# EAGLE design BatteryBalancer (EAGLE 9.2.0)

## Sheet 1 of 4: Connectors
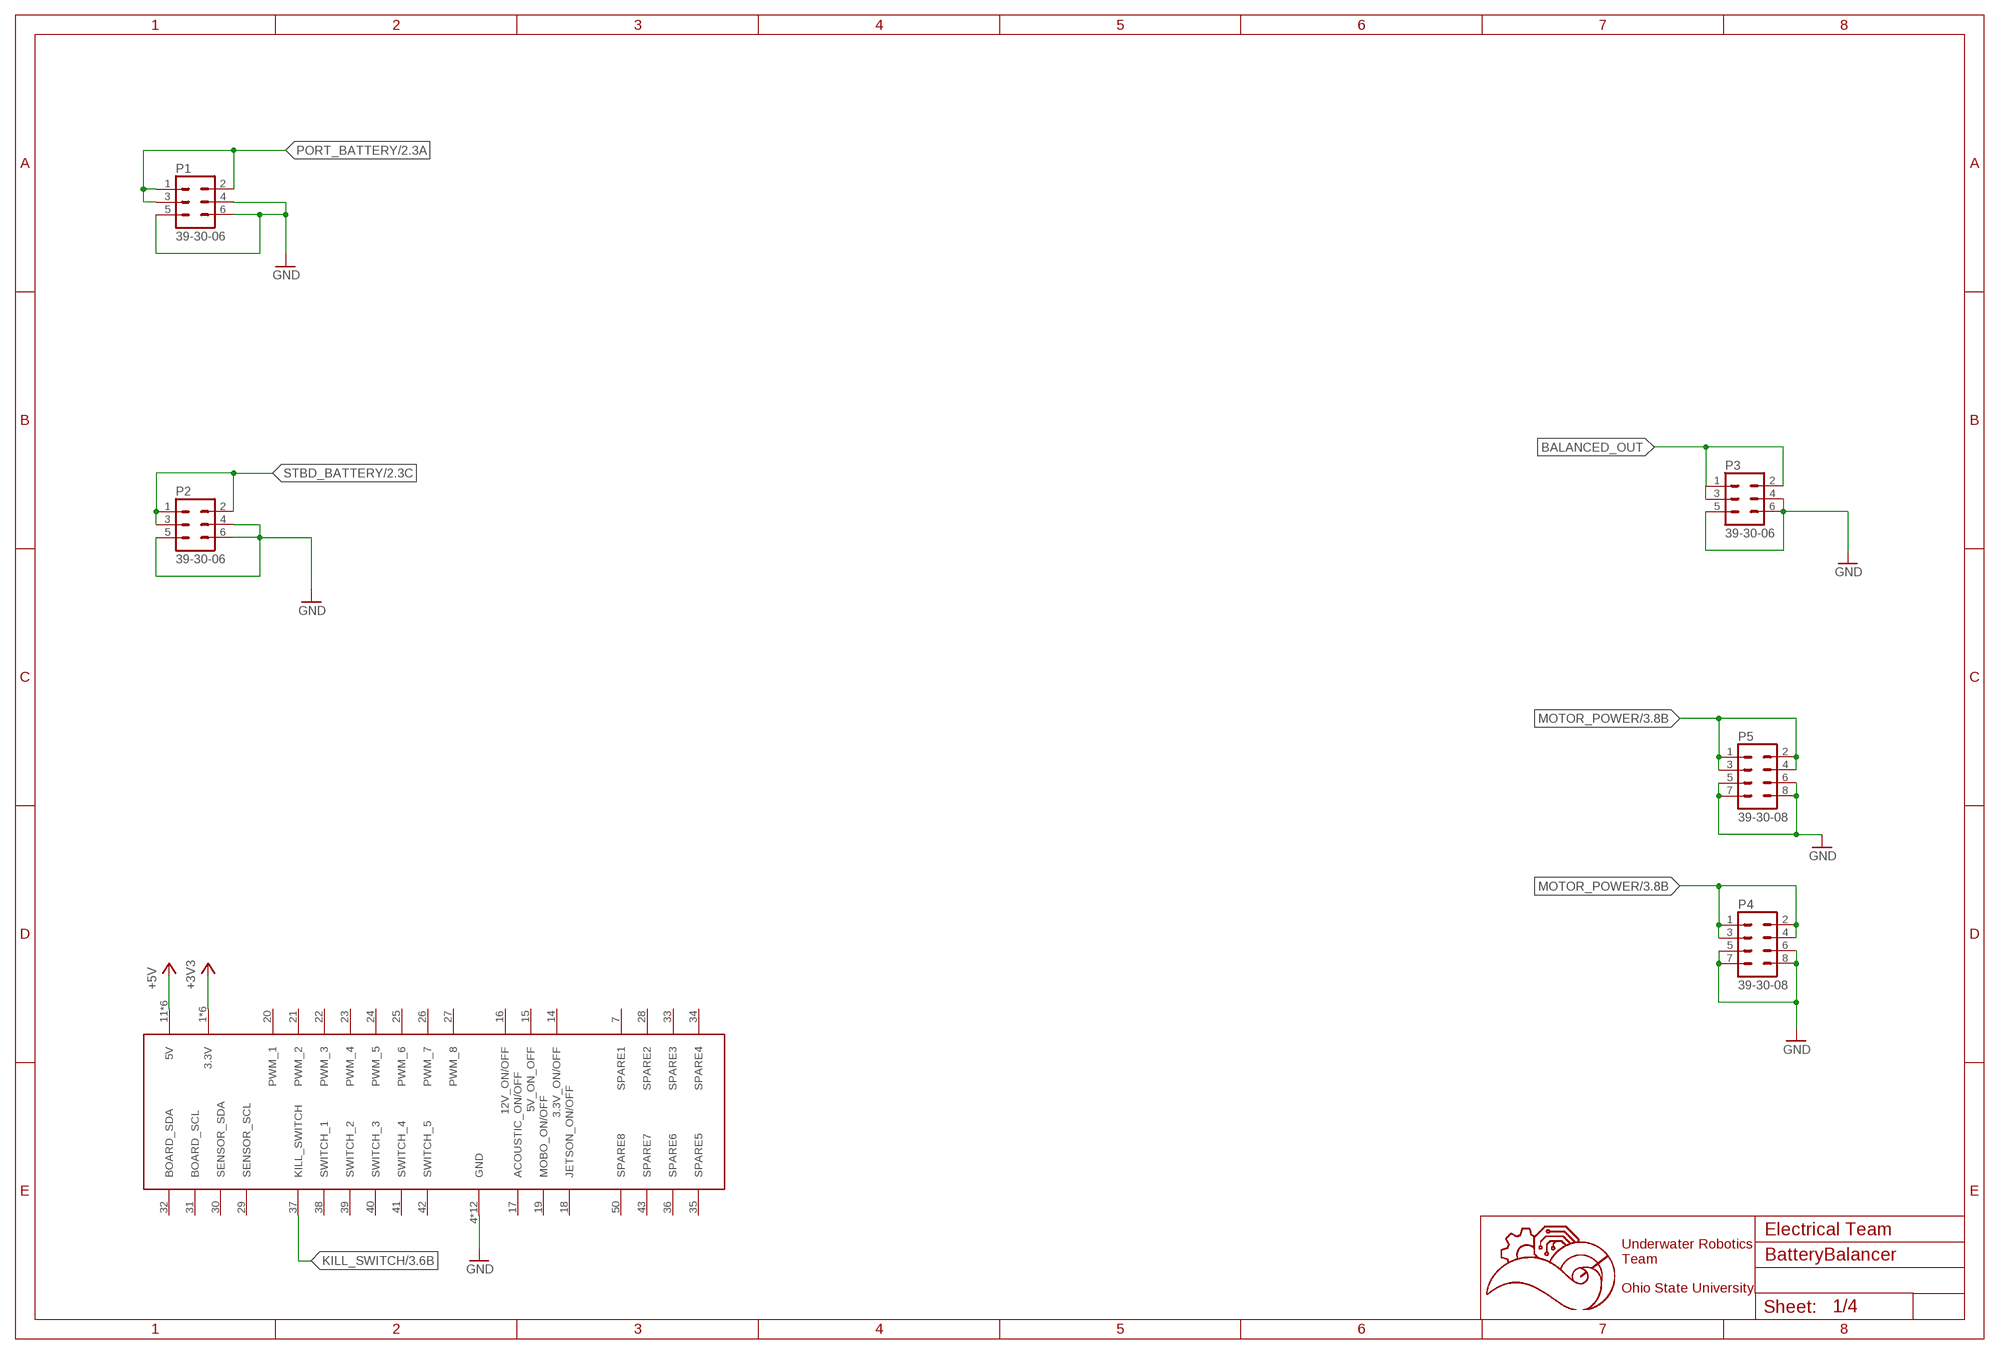
[diagram p0: schematic, sheet 1]

### Parts
P1  39-30-06  [39-30-?06?]
P2  39-30-06  [39-30-?06?]
P3  39-30-06  [39-30-?06?]
P4  39-30-08  [39-30-?08?]
P5  39-30-08  [39-30-?08?]
U$1  5530843-EDGE  [5530843-6-BOARDFINGERS]

### Nets
+3V3: U$1.1(3.3V) U$1.2(3.3V) U$1.3(3.3V) U$1.54(3.3V) U$1.55(3.3V) U$1.56(3.3V) ; also sheet 2
+5V: U$1.11(5V) U$1.12(5V) U$1.13(5V) U$1.44(5V) U$1.45(5V) U$1.46(5V)
BALANCED_OUT: P3.1 P3.2 P3.3
GND: P1.4 P1.5 P1.6 P2.4 P2.5 P2.6 P3.4 P3.5 P3.6 P4.5 P4.6 P4.7 P4.8 P5.5 P5.6 P5.7 P5.8 U$1.4(GND) U$1.5(GND) U$1.6(GND) U$1.8(GND) U$1.9(GND) U$1.10(GND) U$1.47(GND) U$1.48(GND) U$1.49(GND) U$1.51(GND) U$1.52(GND) U$1.53(GND) ; also sheet 2,3
KILL_SWITCH: U$1.37(KILL_SWITCH) ; also sheet 3
MOTOR_POWER: P4.1 P4.2 P4.3 P4.4 P5.1 P5.2 P5.3 P5.4 ; also sheet 3
PORT_BATTERY: P1.1 P1.2 P1.3 ; also sheet 2
STBD_BATTERY: P2.1 P2.2 P2.3 ; also sheet 2
Unconnected: U$1.7(SPARE1) U$1.14(3.3V_ON/OFF) U$1.15(5V_ON_OFF) U$1.16(12V_ON/OFF) U$1.17(ACOUSTIC_ON/OFF) U$1.18(JETSON_ON/OFF) U$1.19(MOBO_ON/OFF) U$1.20(PWM_1) U$1.21(PWM_2) U$1.22(PWM_3) U$1.23(PWM_4) U$1.24(PWM_5) U$1.25(PWM_6) U$1.26(PWM_7) U$1.27(PWM_8) U$1.28(SPARE2) U$1.29(SENSOR_SCL) U$1.30(SENSOR_SDA) U$1.31(BOARD_SCL) U$1.32(BOARD_SDA) U$1.33(SPARE3) U$1.34(SPARE4) U$1.35(SPARE5) U$1.36(SPARE6) U$1.38(SWITCH_1) U$1.39(SWITCH_2) U$1.40(SWITCH_3) U$1.41(SWITCH_4) U$1.42(SWITCH_5) U$1.43(SPARE7) U$1.50(SPARE8)

### Notes on the sheet
- Electrical Team
- Underwater Robotics
  Team
  
  Ohio State University

## Sheet 2 of 4
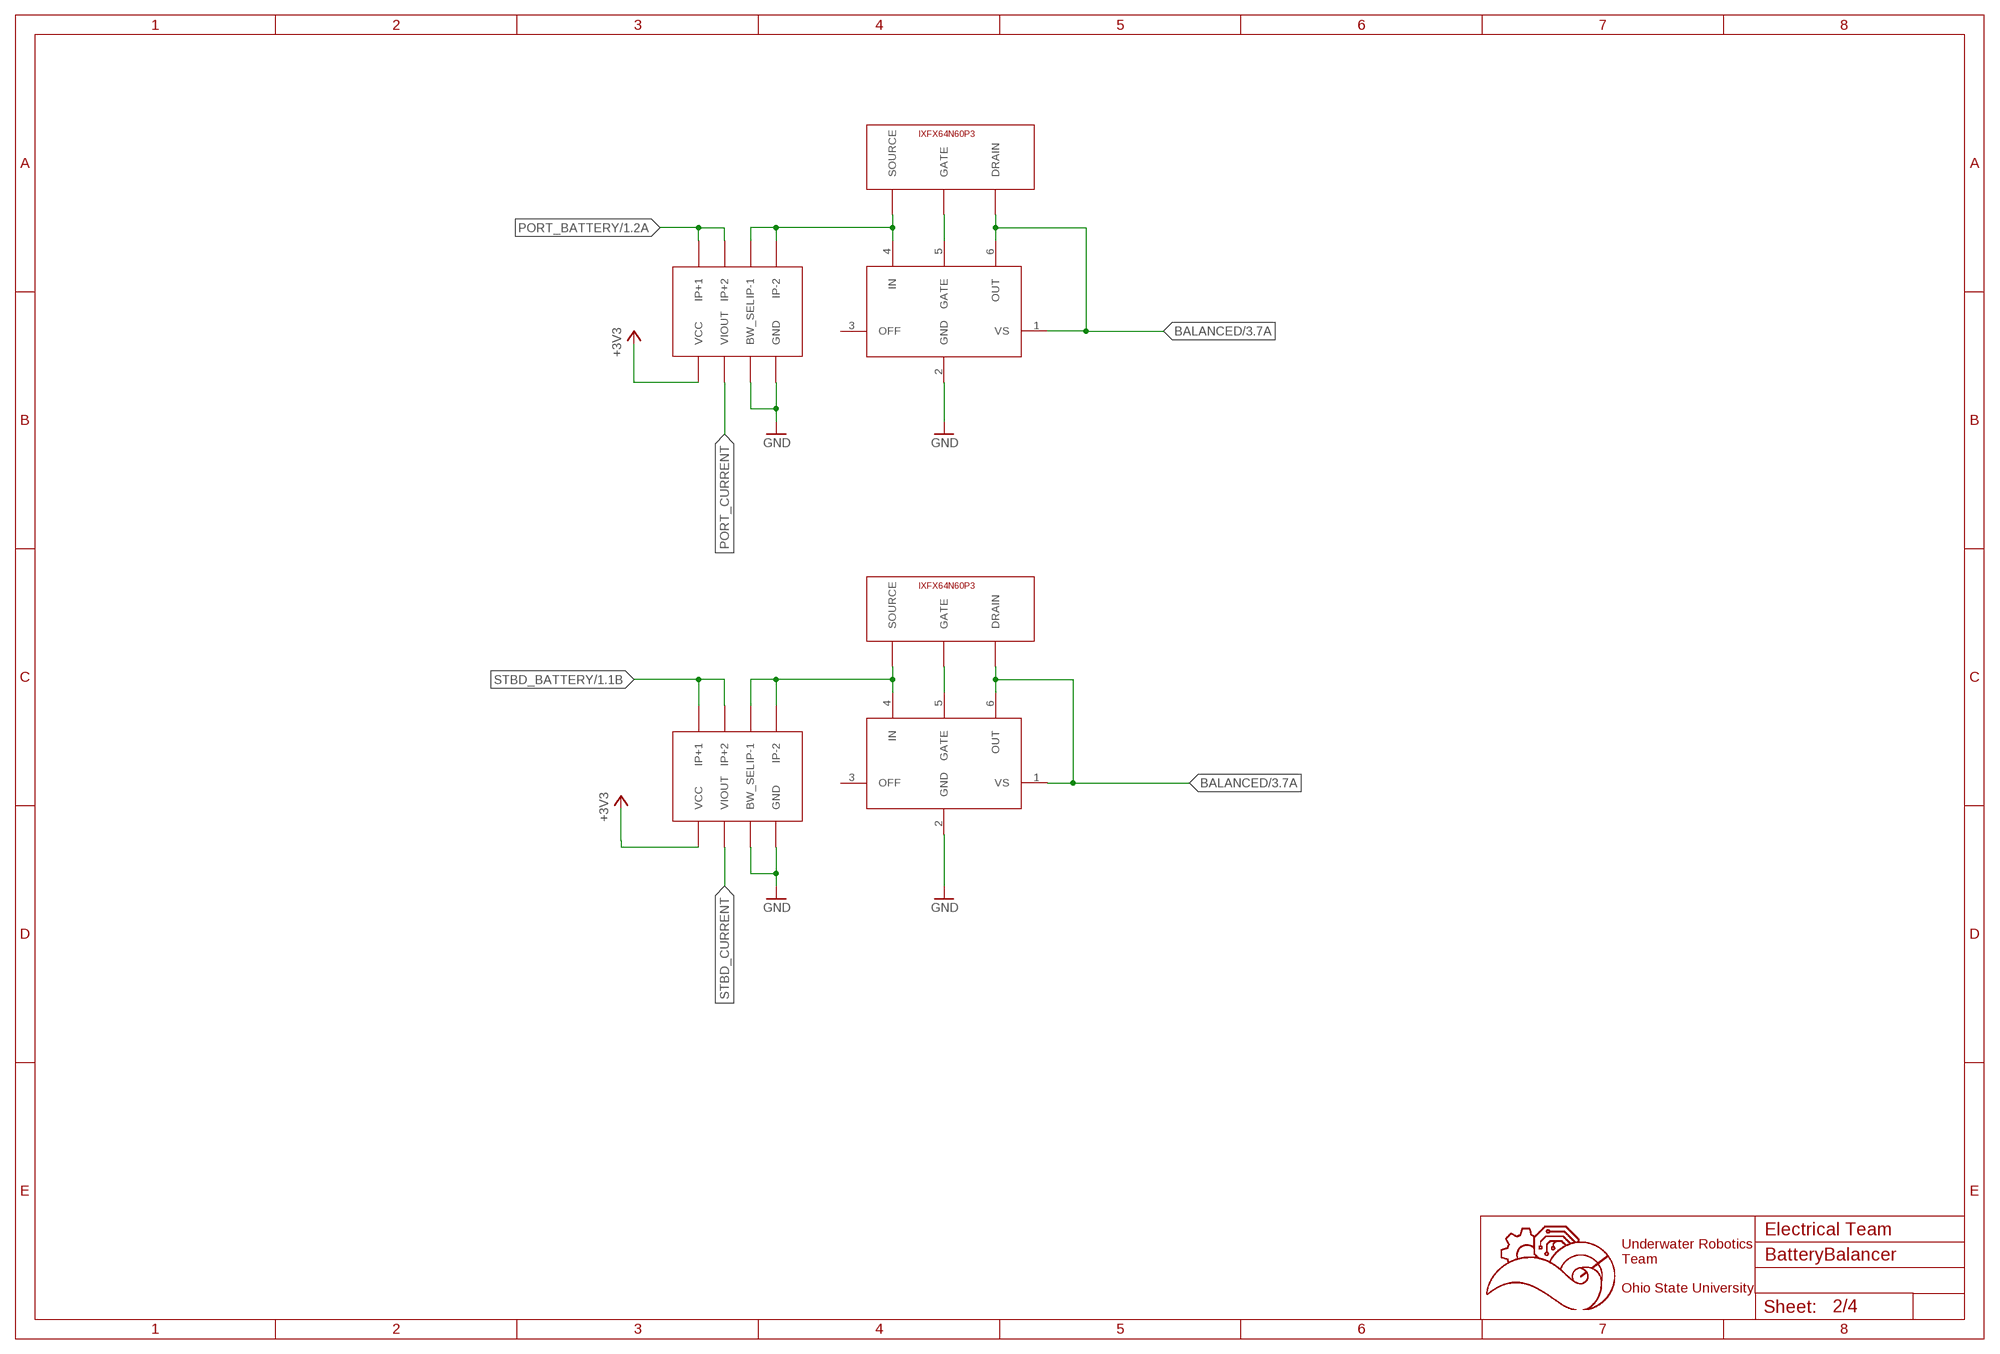
[diagram p1: schematic, sheet 2]

### Parts
U$2  LM5050  [LM5050]
U$3  LM5050  [LM5050]
U$4  IXFX64N60P3  [IXFX64N60P3]
U$5  IXFX64N60P3  [IXFX64N60P3]
U$6  ACS722  [SOIC-8]
U$7  ACS722  [SOIC-8]

### Nets
+3V3: U$6.VCC U$7.VCC ; also sheet 1
BALANCED: U$2.1(VS) U$2.6(OUT) U$3.1(VS) U$3.6(OUT) U$4.DRAIN U$5.DRAIN ; also sheet 3
GND: U$2.2(GND) U$3.2(GND) U$6.BW_SEL U$6.GND U$7.BW_SEL U$7.GND ; also sheet 1,3
N$1: U$2.4(IN) U$4.SOURCE U$6.IP-1 U$6.IP-2
N$2: U$2.5(GATE) U$4.GATE
N$4: U$3.4(IN) U$5.SOURCE U$7.IP-1 U$7.IP-2
N$5: U$3.5(GATE) U$5.GATE
PORT_BATTERY: U$6.IP+1 U$6.IP+2 ; also sheet 1
PORT_CURRENT: U$6.VIOUT
STBD_BATTERY: U$7.IP+1 U$7.IP+2 ; also sheet 1
STBD_CURRENT: U$7.VIOUT
Unconnected: U$2.3(OFF) U$3.3(OFF)

### Notes on the sheet
- Electrical Team
- Underwater Robotics
  Team
  
  Ohio State University

## Sheet 3 of 4
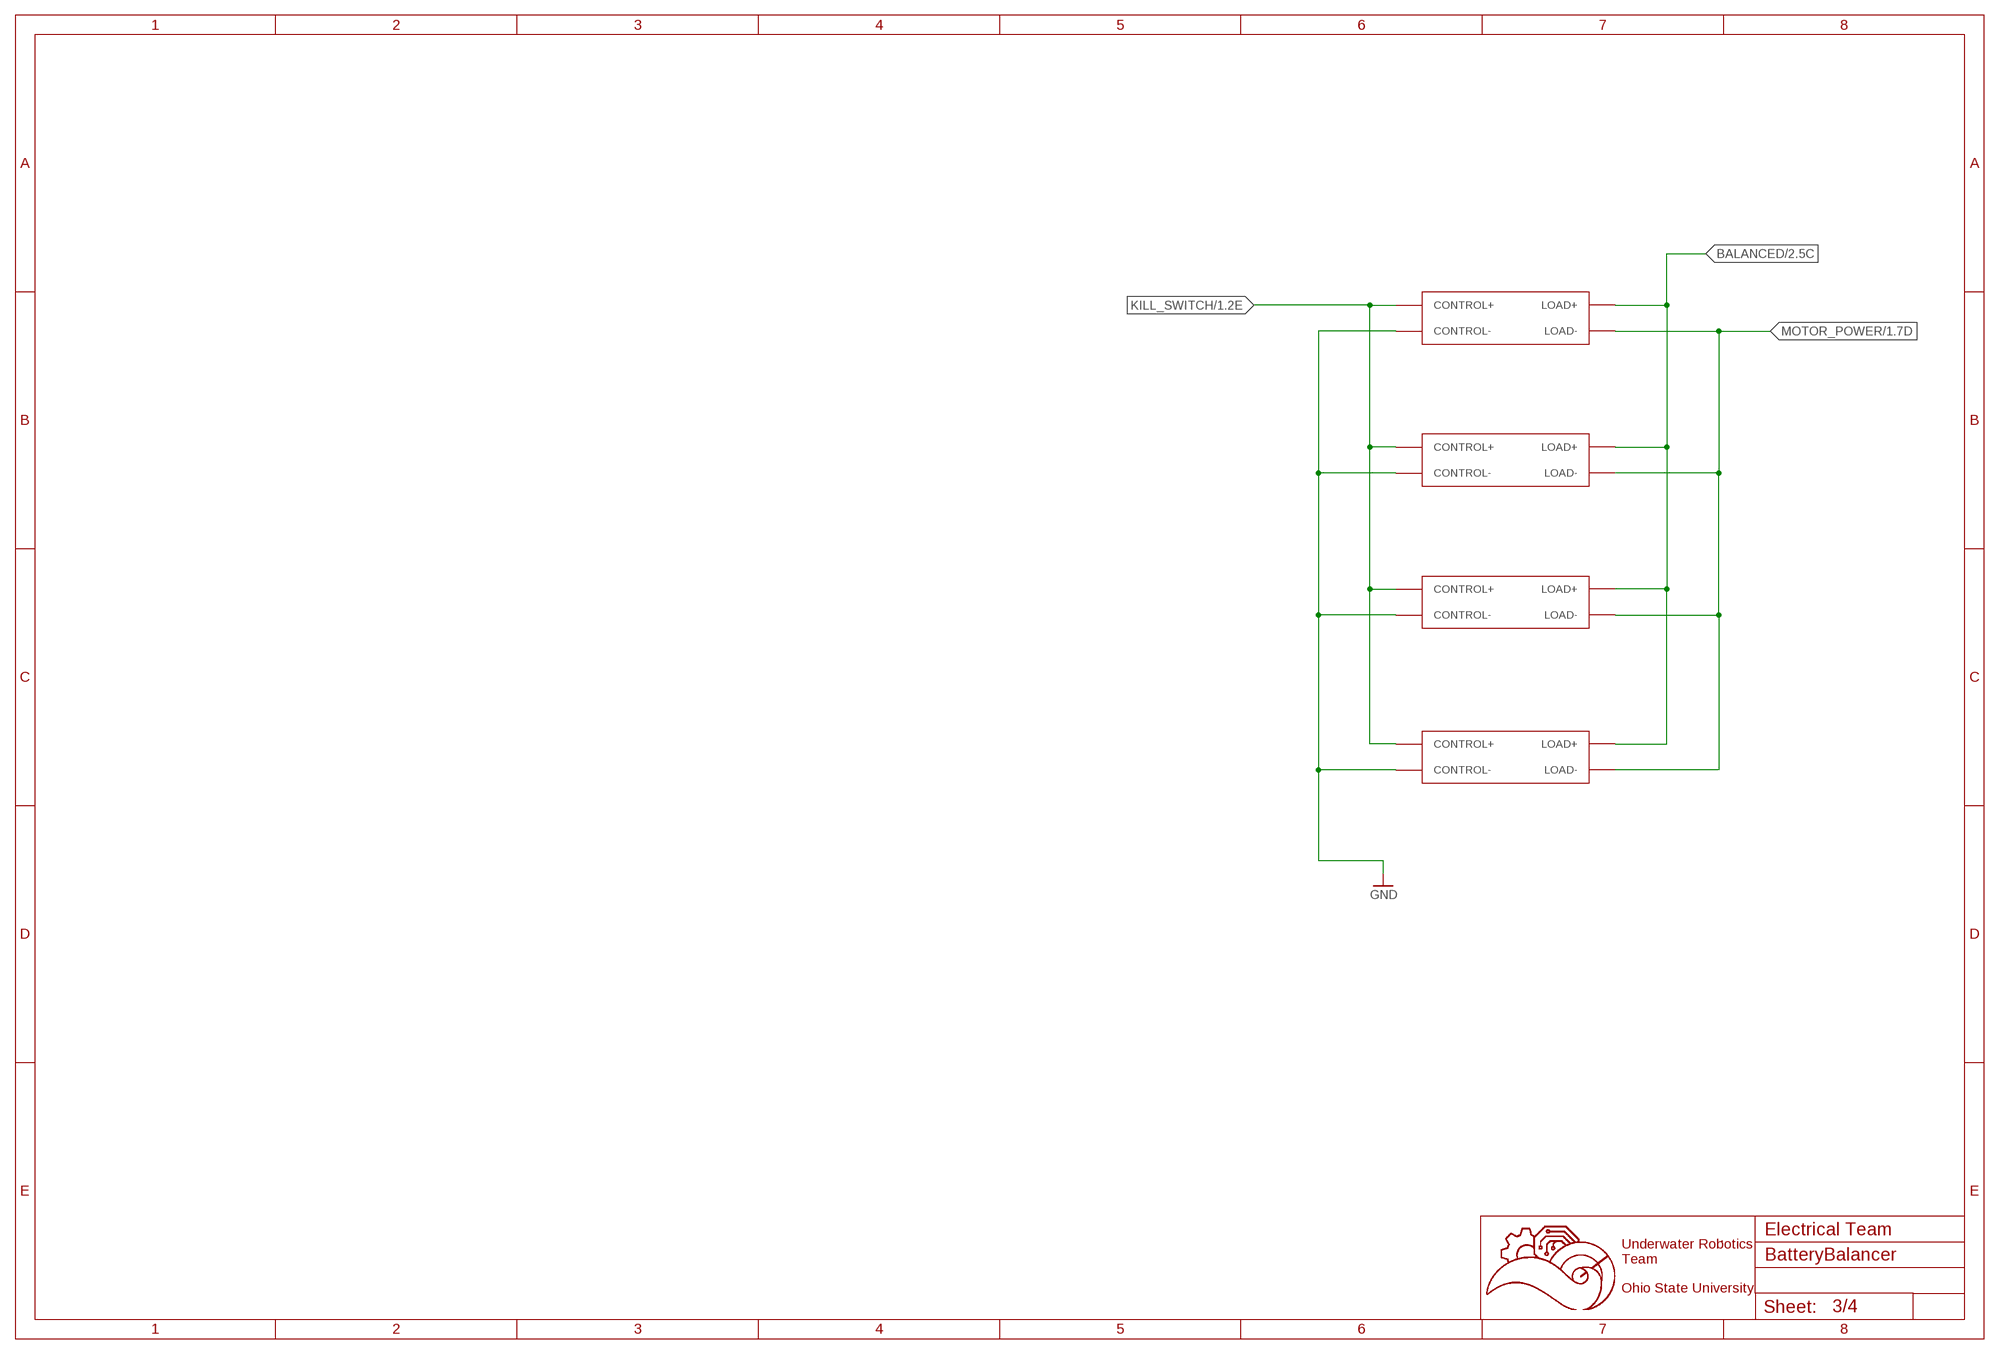
[diagram p2: schematic, sheet 3]

### Parts
U$8  CMX60D20  [CMX60D20]
U$9  CMX60D20  [CMX60D20]
U$10  CMX60D20  [CMX60D20]
U$11  CMX60D20  [CMX60D20]

### Nets
BALANCED: U$8.LOAD+ U$9.LOAD+ U$10.LOAD+ U$11.LOAD+ ; also sheet 2
GND: U$8.CONTROL- U$9.CONTROL- U$10.CONTROL- U$11.CONTROL- ; also sheet 1,2
KILL_SWITCH: U$8.CONTROL+ U$9.CONTROL+ U$10.CONTROL+ U$11.CONTROL+ ; also sheet 1
MOTOR_POWER: U$8.LOAD- U$9.LOAD- U$10.LOAD- U$11.LOAD- ; also sheet 1

### Notes on the sheet
- Electrical Team
- Underwater Robotics
  Team
  
  Ohio State University

## Sheet 4 of 4
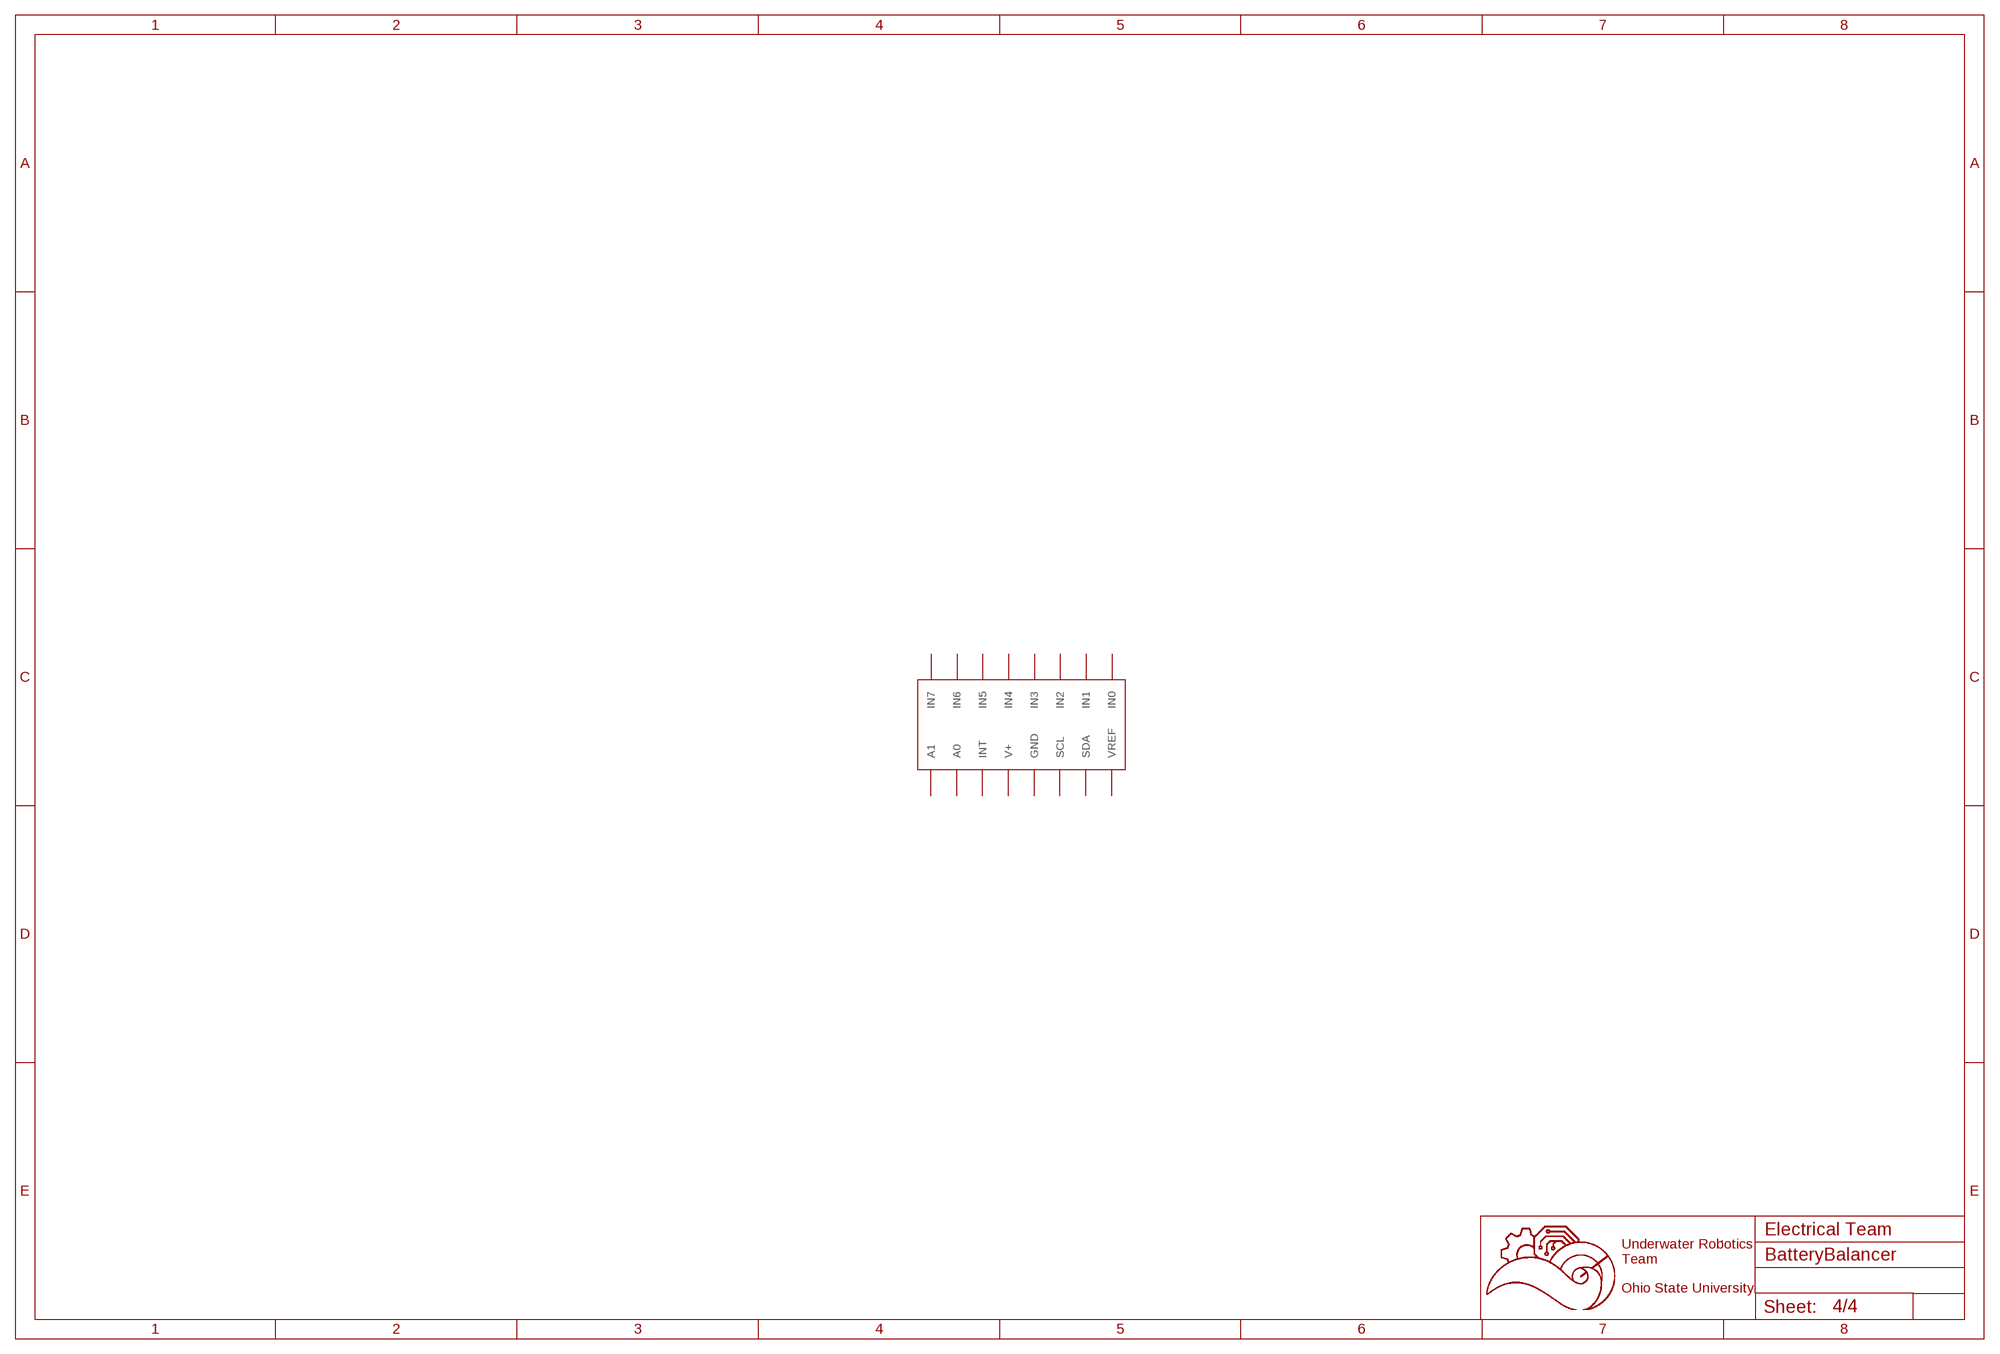
[diagram p3: schematic, sheet 4]

### Parts
U$12  ADC128D818  [TSSOP-16]
Unconnected: U$12.A0 U$12.A1 U$12.GND U$12.IN0 U$12.IN1 U$12.IN2 U$12.IN3 U$12.IN4 U$12.IN5 U$12.IN6 U$12.IN7 U$12.INT U$12.SCL U$12.SDA U$12.V+ U$12.VREF

### Notes on the sheet
- Electrical Team
- Underwater Robotics
  Team
  
  Ohio State University

## Library data of the parts
P1-P3 = con-molex-mini-fit:39-30-?06?: HEADER
P4 P5 = con-molex-mini-fit:39-30-?08?: HEADER
U$1 = 5530843-6:5530843-EDGE
U$2 U$3 = LM5050:LM5050
U$4 U$5 = IXFX64N60P3:IXFX64N60P3
U$6 U$7 = ACS722:ACS722
U$8-U$11 = CMX60D20:CMX60D20
U$12 = ADC128D818:ADC128D818

## Board
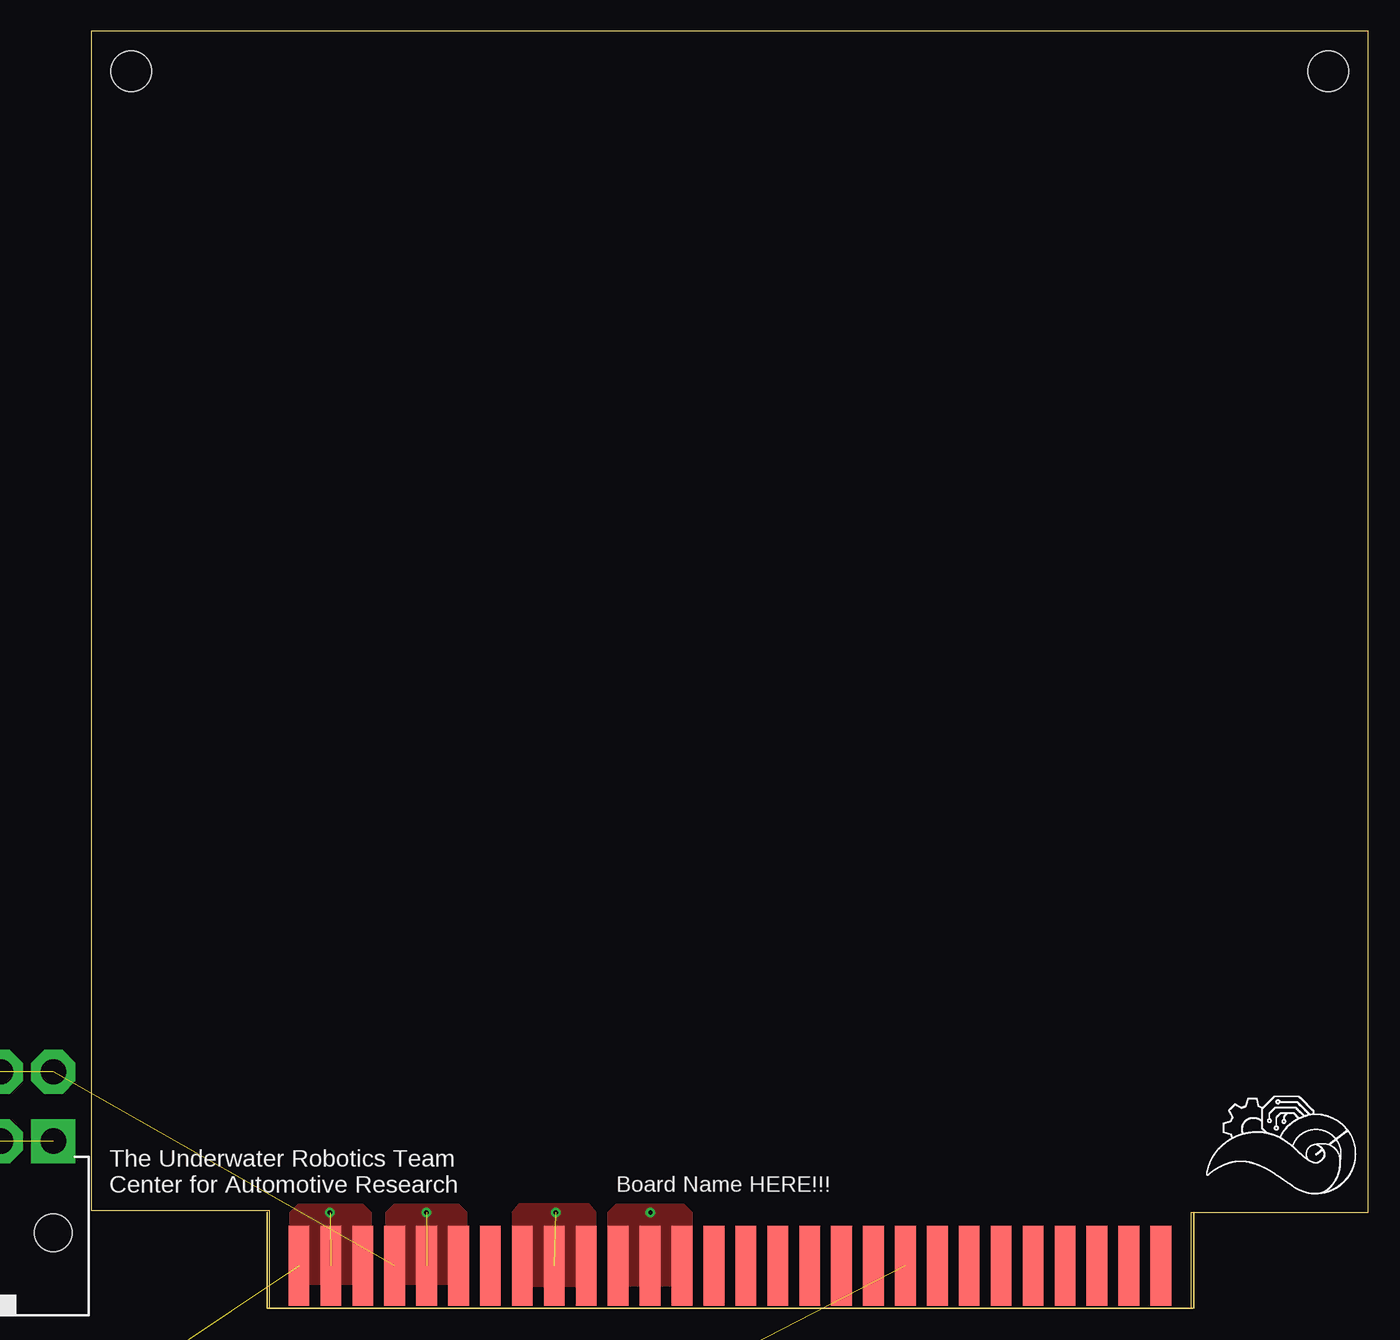
[diagram p4: board, top side]
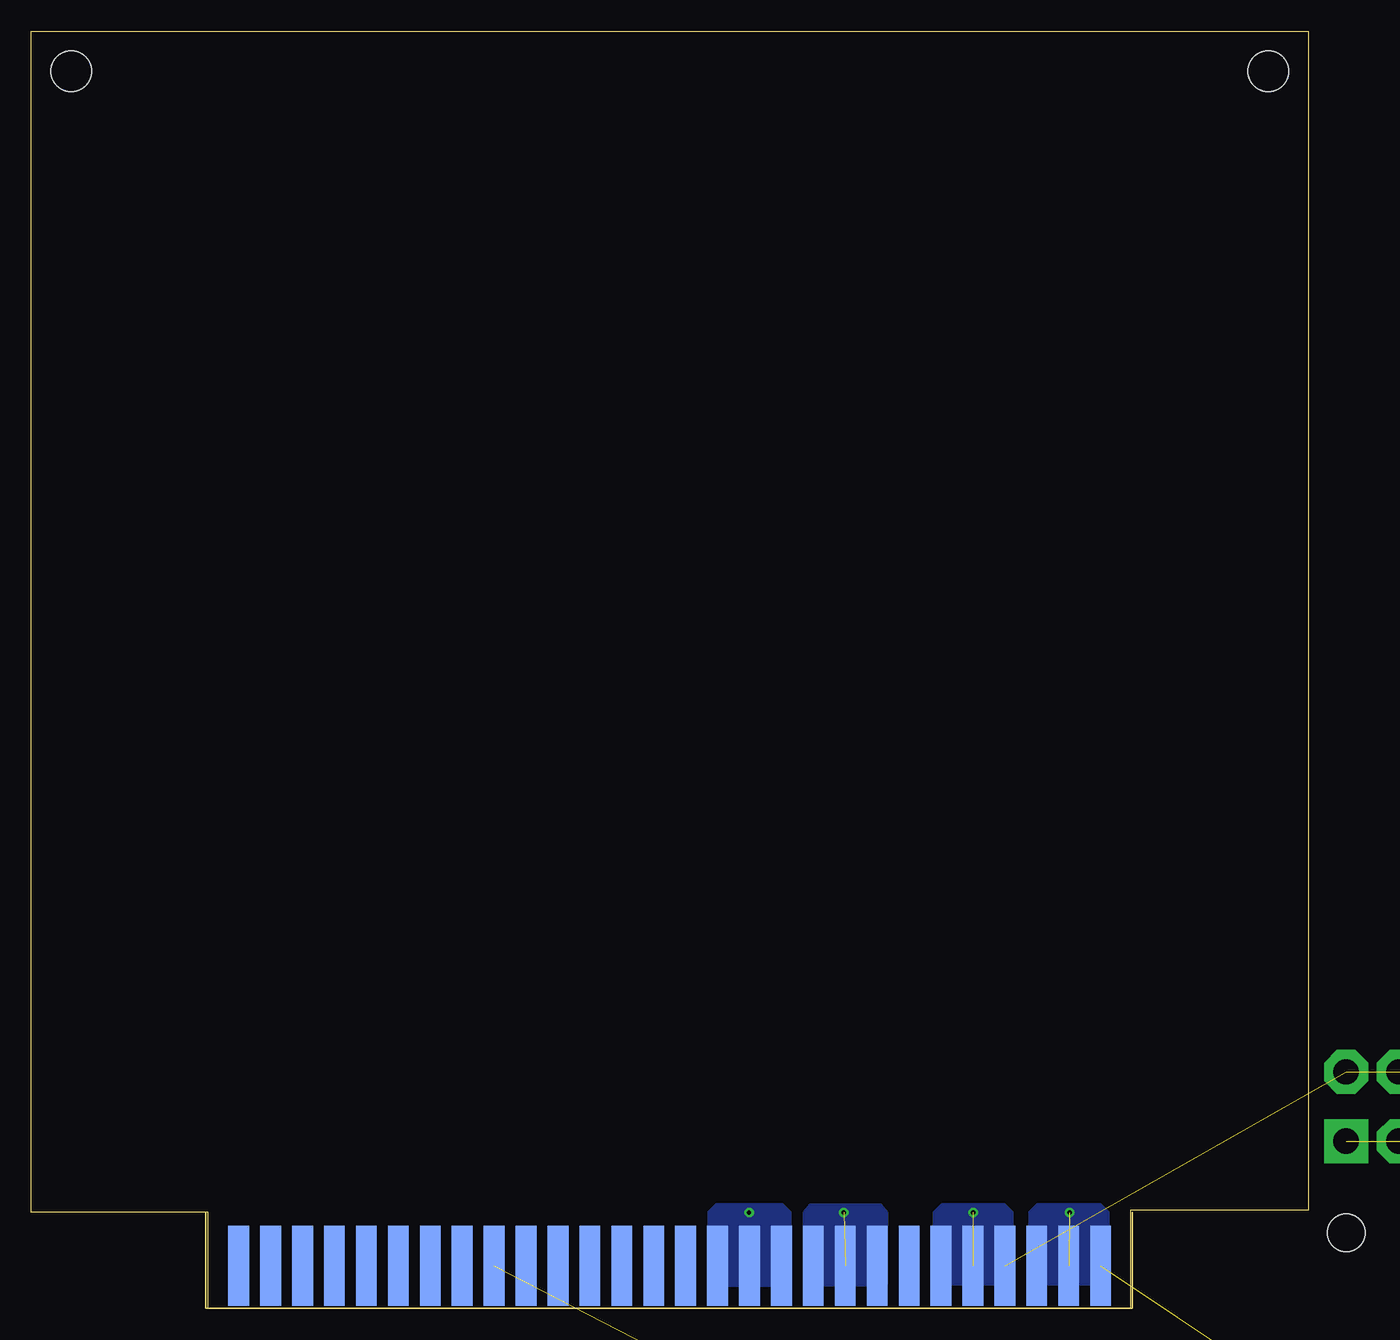
[diagram p5: board, bottom side, seen from below]

Size 101.6 x 101.6 mm. Coordinates in mm from the lower left corner, seen from the top.
Outline: 0,7.8 13.66,7.8 14.14,7.8 14.14,0 87.53,0 87.53,7.62 101.6,7.62 101.6,101.6 0,101.6 0,7.8
Copper layers (1*16): Top 0.035mm / dielectric 1.5mm / Bottom 0.035mm
Design rules "default *": minimum track width 6mil, minimum drill 0.35mm, track to track 6mil, track to pad 6mil, pad to pad 6mil, via to via 6mil, smd to smd 6mil, copper to edge 0.00508125mm, drill to drill 6mil, minimum pad ring 10mil, minimum via ring 8mil, stop-mask expansion 4mil, vias tented up to drill 0mil, thermal gap 10mil
Holes 3.26 mm at 3.17,98.42 98.42,98.42

### Footprints (pad centres in the part's own frame; a part is rotated, then mirrored left to right if it is on the bottom)
39-30-?06? = drill 2 pad 3.5 square: 1 4.191,0 | drill 2 pad 3.5 octagon: 2 0,0; 3 -4.191,0; 4 4.191,5.512; 5 0,5.512; 6 -4.191,5.512 | hole 3: -4.191,-7.3; 4.191,-7.3
39-30-?08? = drill 2 pad 3.5 square: 1 6.287,0 | drill 2 pad 3.5 octagon: 2 2.095,0; 3 -2.095,0; 4 -6.287,0; 5 6.287,5.512; 6 2.095,5.512; 7 -2.095,5.512; 8 -6.287,5.512 | hole 3: -6.287,-7.3; 6.287,-7.3
5530843-6-BOARDFINGERS = smd 1.651 x 6.35 bottom: 1 0.826,3.375; 2 3.365,3.375; 3 5.905,3.375; 4 8.445,3.375; 5 10.986,3.375; 6 13.525,3.375; 7 16.066,3.375; 8 18.605,3.375; 9 21.145,3.375; 10 23.686,3.375; 11 26.226,3.375; 12 28.765,3.375; 13 31.305,3.375; 14 33.846,3.375; 15 36.386,3.375; 16 38.925,3.375; 17 41.465,3.375; 18 44.005,3.375; 19 46.545,3.375; 20 49.086,3.375; 21 51.626,3.375; 22 54.166,3.375; 23 56.706,3.375; 24 59.245,3.375; 25 61.785,3.375; 26 64.326,3.375; 27 66.865,3.375; 28 69.406,3.375 | smd 1.651 x 6.35: 29 69.406,3.375; 30 66.865,3.375; 31 64.326,3.375; 32 61.785,3.375; 33 59.245,3.375; 34 56.706,3.375; 35 54.166,3.375; 36 51.626,3.375; 37 49.086,3.375; 38 46.545,3.375; 39 44.005,3.375; 40 41.465,3.375; 41 38.925,3.375; 42 36.386,3.375; 43 33.846,3.375; 44 31.305,3.375; 45 28.765,3.375; 46 26.226,3.375; 47 23.686,3.375; 48 21.145,3.375; 49 18.605,3.375; 50 16.066,3.375; 51 13.525,3.375; 52 10.986,3.375; 53 8.445,3.375; 54 5.905,3.375; 55 3.365,3.375; 56 0.826,3.375
LM5050 = smd 0.635 x 1.27: 1 0,0; 2 0.95,0; 3 1.9,0; 4 1.9,2.7; 5 0.95,2.7; 6 0,2.7
IXFX64N60P3 = drill 2.286 pad 4.064: DRAIN -1.27,0; GATE -6.604,0; SOURCE 4.191,0
SOIC-8 = smd 0.61 x 2.21: BW_SEL 0.635,2.616; GND 1.905,2.616; IP+1 -1.905,-2.616; IP+2 -0.635,-2.616; IP-1 0.635,-2.616; IP-2 1.905,-2.616; VCC -1.905,2.616; VIOUT -0.635,2.616
CMX60D20 = drill 2.2 pad 4 square: CONTROL+ -8.87,0; CONTROL- -13.97,0; LOAD+ 13.93,0; LOAD- 3.83,0
TSSOP-16 = smd 0.9 x 0.35: A0 -2.875,-1.625; A1 -2.875,-2.275; GND -2.875,0.325; IN0 2.875,2.275; IN1 2.875,1.625; IN2 2.875,0.975; IN3 2.875,0.325; IN4 2.875,-0.325; IN5 2.875,-0.975; IN6 2.875,-1.625; IN7 2.875,-2.275; INT -2.875,-0.975; SCL -2.875,0.975; SDA -2.875,1.625; V+ -2.875,-0.325; VREF -2.875,2.275

### Placement (x,y rotation side)
P1  39-30-06?  [39-30-?06?]  -7.2,13.3 0 top  (outside the outline)
P2  39-30-06?  [39-30-?06?]  -24.2,13.3 0 top  (outside the outline)
P3  39-30-06?  [39-30-?06?]  -41.2,13.3 0 top  (outside the outline)
P4  39-30-08?  [39-30-?08?]  -39.8,-8.4 0 top  (outside the outline)
P5  39-30-08?  [39-30-?08?]  -39.8,-30.1 0 top  (outside the outline)
U$1  15.7,0 0 top
U$2  -60.8,-59.7 0 top  (outside the outline)
U$3  -64.4,-59.9 0 top  (outside the outline)
U$4  -46.7,-48.8 0 top  (outside the outline)
U$5  -46.7,-56.6 0 top  (outside the outline)
U$6  -67.9,-57 0 top  (outside the outline)
U$7  -72.8,-57 0 top  (outside the outline)
U$8  -56.1,-63.6 0 top  (outside the outline)
U$9  -56.1,-71.4 0 top  (outside the outline)
U$10  -56.1,-79.2 0 top  (outside the outline)
U$11  -56.1,-87 0 top  (outside the outline)
U$12  -78.9,-89.6 0 top  (outside the outline)

### Tracks (layer width: path | path; a pad name or v marks a point on that pad's centre or on a via)
+3V3  (via drill 0.35)  (3 unrouted)
  other vias: 19,7.6
  pour Bottom (no thermals): 15.88,7.62 16.51,8.26 21.59,8.26 22.23,7.62 22.23,1.91 15.88,1.91
  pour Top (no thermals): 15.88,7.62 16.51,8.26 21.59,8.26 22.23,7.62 22.23,1.91 15.88,1.91
+5V  (via drill 0.35)
  other vias: 44.5,7.6
  pour Top (no thermals): 41.15,1.78 41.15,7.62 41.78,8.26 47.12,8.26 47.75,7.62 47.75,1.78
  pour Bottom (no thermals): 41.15,1.78 41.15,7.62 41.78,8.26 47.12,8.26 47.75,7.62 47.75,1.78
BALANCED  (9 unrouted)
BALANCED_OUT  (2 unrouted)
GND  (via drill 0.35)  (29 unrouted)
  other vias: 26.67,7.62 36.96,7.62
  pour Top (no thermals): 23.5,7.62 24.13,8.26 29.21,8.26 29.84,7.62 29.84,1.91 23.5,1.91
  pour Bottom (no thermals): 23.5,7.62 24.13,8.26 29.21,8.26 29.84,7.62 29.84,1.91 23.5,1.91
  pour Top (no thermals): 33.66,1.78 40.13,1.78 40.13,7.62 39.62,8.26 34.04,8.26 33.53,7.62 33.53,1.91
  pour Bottom (no thermals): 33.53,7.62 33.53,1.91 33.66,1.78 40.01,1.78 40.01,4.06 40.01,5.71 40.13,5.84 40.13,7.62 39.62,8.26 34.04,8.26
KILL_SWITCH  (4 unrouted)
MOTOR_POWER  (11 unrouted)
N$1  (3 unrouted)
N$2  (1 unrouted)
N$4  (3 unrouted)
N$5  (1 unrouted)
PORT_BATTERY  (4 unrouted)
STBD_BATTERY  (4 unrouted)

### Text on the board
tPlace: The Underwater Robotics Team / Center for Automotive Research | Board Name HERE!!!